# Altium schematic sheet llrf_afe_usb_ftdi.SchDoc: =GlobalProjectName
size 209 x 297 mm; SheetNumber: 16; SheetTotal: 17; PageSetup: Record=PageOptions|CenterHorizontal=True|CenterVertical=True|PrintScale=1.00|XCorrection=1.00|YCorrection=1.00|PrintKind=1|BorderSize=5000000|LeftOffset=0|BottomOffset=0|Orientation=2|PaperLength=1000|PaperWidth=1000|Scale=100|PaperSource=15|PrintQuality=1200|MediaType=1|DitherType=10|PaperKind=A3|PrintScaleMode=1; Weight: -; ScaleFactor: -
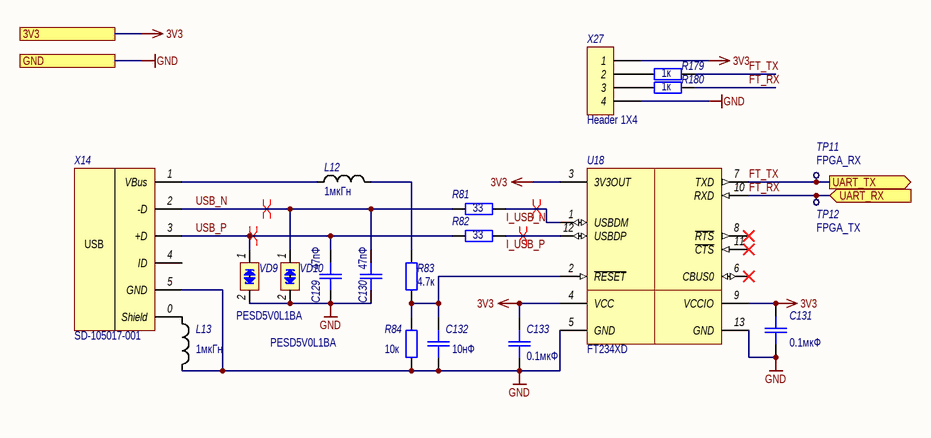
[diagram p0: llrf_afe_usb_ftdi.SchDoc]

## Parts
C129  47пФ  [SMD_C0402]
C130  47пФ  [SMD_C0402]
C131  0.1мкФ  [SMD_C0402]
C132  10нФ  [SMD_C0402]
C133  0.1мкФ  [SMD_C0402]
L12  1мкГн  [SMD_0805]
L13  1мкГн  [SMD_0805]
R81  33  [SMD_0603]
R82  33  [SMD_0603]
R83  4.7к  [SMD_0603]
R84  10к  [SMD_0603]
R179  1к  [SMD_0603]
R180  1к  [SMD_0603]
TP11  FPGA_RX  [TestPoint]
TP12  FPGA_TX  [TestPoint]
U18  FT234XD  [DFN-12]
VD9  Наименование: PESD5V0L1BA  [SOD-323]  (hidden comment: PESD5V0)
VD10  Наименование: PESD5V0L1BA  [SOD-323]  (hidden comment: PESD5V0)
X14  Наименование: SD-105017-001  [MicroUSB-Molex-105017]  (hidden comment: mico-BF)
X27  Header 1X4  [PLS-4]

## Ports
3V3, GND, UART_RX (in), UART_TX (out)

## Nets
3V3: C131.2 C133.2 U18.3(3V3OUT) U18.4(VCC) U18.9(VCCIO) X27.1 ; port 3V3
GND: C129.1 C130.1 C131.1 C132.1 C133.1 L13.2 R84.1 U18.5(GND) U18.13(GND) VD9.2(cathode_2) VD10.2(cathode_2) X14.5(GND) X27.4 ; port GND
FT_RX: R180.1 TP12.0(TP) U18.10(RXD) ; port UART_RX
FT_TX: R179.1 TP11.0(TP) U18.7(TXD) ; port UART_TX
I_USB_N: R81.1 U18.1(USBDM)
I_USB_P: R82.1 U18.12(USBDP)
USB_N: C130.2 R81.2 VD10.1(cathode_1) X14.2(-D)
USB_P: C129.2 R82.2 VD9.1(cathode_1) X14.3(+D)
NetC132_2: C132.2 R83.2 R84.2 U18.2(~{RESET})
NetL12_1: L12.1 X14.1(VBus)
NetL12_2: L12.2 R83.1
NetL13_1: L13.1 X14.0(Shield)
NetR179_2: R179.2 X27.2
NetR180_2: R180.2 X27.3

Not connected (* = marked no-connect by the designer): U18 6(CBUS0)* 8(~{RTS})* 11(~{CTS})*; X14 4(ID)

## Layout directives
differential pair: I_USB_N, I_USB_P, USB_N, USB_P

## Notes on the sheet
- Подп. и дата
- Инв. № дубл.
- Взам. инв. №
- Инв. № подл.
- Изм.
- Лист
- № докум.
- Подп.
- Дата
- Форма 2а ГОСТ 2.104-2006
- Копировал
- Формат А4
- (in symbol MicroUSB) USB

## Library data of the parts
C129-C133 = Capacitor: Назначение: SMD-конденсатор; Наименование: Конденсатор; Потребление, Вт: 0
  C129 C130: Value: 47пФ
  C131 C133: Value: 0.1мкФ
  C132: Value: 10нФ
L12 L13 = Inductor: Наименование: Индуктивность; Назначение: SMD-индуктивность; Потребление, Вт: 0,010; Value: 1мкГн
R81-R84 R179 R180 = Resistor: PE1206DRM470R01L; Наименование: Резистор; Назначение: SMD-резистор; Потребление, Вт: 0,001
  R81 R82: Value: 33
  R83: Value: 4.7к
  R84: Value: 10к
  R179 R180: Value: 1к
TP11 TP12 = TP: Наименование: Точка проверки; Назначение: Контроль параметров платы
  TP11: TP_Name: FPGA_RX
  TP12: TP_Name: FPGA_TX
U18 = FT234XD: USB TO BASIC UART IC; Потребление, Вт: 0.03; Назначение: USB TO BASIC UART IC; ComponentLink1Description: DataSheet; ComponentLink1URL: https://ftdichip.com/wp-content/uploads/2020/08/DS_FT234XD.pdf; Supplier 1: Newark; Supplier Part Number 1: 53X3171; Наименование: FT234XD
VD9 VD10 = PESDxL1BA: Low capacitance bidirectional ESD protection diodes; Назначение: ESD защитные диоды; Потребление, Вт: 0.0; ComponentLink1Description: DataSheet; ComponentLink1URL: https://static.chipdip.ru/lib/635/DOC005635911.pdf
X14 = MicroUSB: MicroUSB bottom mount receptacle, B-type; Потребление, Вт: 0; Назначение: MicroUSB bottom mount receptacle, B-type; DataSheet: *
X27 = Header 1X4: Header, 4-Pin, Single row; Потребление, Вт: 0,0; Назначение: Header, 4-Pin, Single row; Наименование: Header 1X4